# EAGLE design integrator (EAGLE 7.1.0)
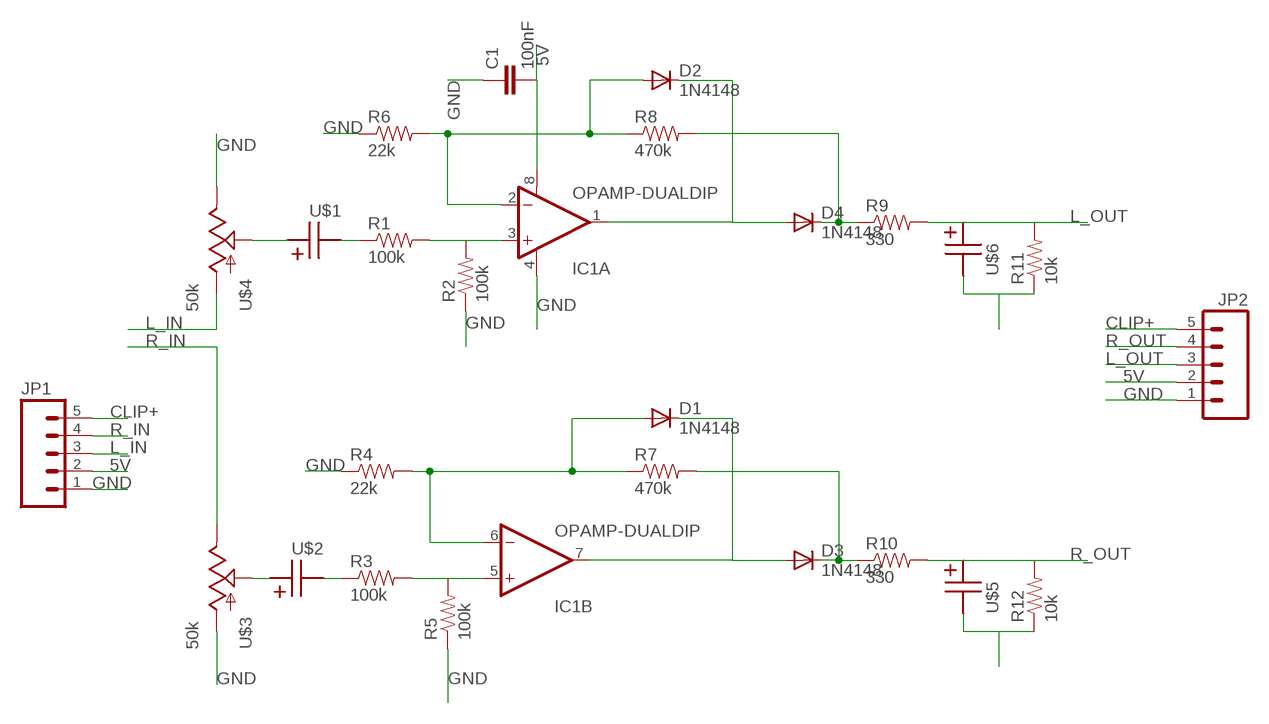
[diagram p0: schematic, sheet 1]

## Parts
C1  100nF  CAP1206  [1206]
D1  1N4148  DIODE1N4148  [DIODE-1N4148]
D2  1N4148  DIODE1N4148  [DIODE-1N4148]
D3  1N4148  DIODE1N4148  [DIODE-1N4148]
D4  1N4148  DIODE1N4148  [DIODE-1N4148]
IC1  OPAMP-DUALDIP  [DIP08]
JP1  M05SMD2  [1X05-1MM-RA]
JP2  M05SMD2  [1X05-1MM-RA]
R1  100k  RESISTORPTH-1/4W  [AXIAL-0.4]
R2  100k  RESISTORPTH-1/4W  [AXIAL-0.4]
R3  100k  RESISTORPTH-1/4W  [AXIAL-0.4]
R4  22k  RESISTORPTH-1/4W  [AXIAL-0.4]
R5  100k  RESISTORPTH-1/4W  [AXIAL-0.4]
R6  22k  RESISTORPTH-1/4W  [AXIAL-0.4]
R7  470k  RESISTORPTH-1/4W  [AXIAL-0.4]
R8  470k  RESISTORPTH-1/4W  [AXIAL-0.4]
R9  330  RESISTORPTH-1/4W  [AXIAL-0.4]
R10  330  RESISTORPTH-1/4W  [AXIAL-0.4]
R11  10k  RESISTORPTH-1/4W  [AXIAL-0.4]
R12  10k  RESISTORPTH-1/4W  [AXIAL-0.4]
U$1  6.8uF  5MM-12.5MM-POLAR2MMX5MM  [2MMLEAD_5MMDIAMETER]
U$2  6.8uF  5MM-12.5MM-POLAR2MMX5MM  [2MMLEAD_5MMDIAMETER]
U$3  50k  POT  [ALPS_POT]
U$4  50k  POT  [ALPS_POT]
U$5  2.2uF  5MM-12.5MM-POLAR2MMX5MM  [2MMLEAD_5MMDIAMETER]
U$6  2.2uF  5MM-12.5MM-POLAR2MMX5MM  [2MMLEAD_5MMDIAMETER]

## Nets
5V: C1.2 IC1.8(A:V+) JP1.2 JP2.2
CLIP+: JP1.5 JP2.5
GND: C1.1 IC1.4(A:V-) JP1.1 JP2.1 R2.P$1 R4.P$1 R5.P$1 R6.P$1 R11.P$1 R12.P$1 U$3.P$3(A) U$4.P$1(E) U$5.- U$6.-
L_IN: JP1.3 U$4.P$3(A)
L_OUT: JP2.3 R9.P$2 R11.P$2 U$6.+
N$2: D1.A IC1.6(B:-IN) R4.P$2 R7.P$1
N$4: D2.A IC1.2(A:-IN) R6.P$2 R8.P$1
N$6: IC1.5(B:+IN) R3.P$2 R5.P$2
N$7: IC1.3(A:+IN) R1.P$2 R2.P$2
N$11: D1.C D3.A IC1.7(B:OUT)
N$12: D3.C R7.P$2 R10.P$1
N$13: D4.C R8.P$2 R9.P$1
N$14: D2.C D4.A IC1.1(A:OUT)
N$15: U$2.+ U$3.P$2(S)
N$16: R1.P$1 U$1.-
N$17: R3.P$1 U$2.-
N$19: U$1.+ U$4.P$2(S)
R_IN: JP1.4 U$3.P$1(E)
R_OUT: JP2.4 R10.P$2 R12.P$2 U$5.+

## Library data of the parts
C1 = SparkFun-Capacitors:CAP: Capacitor Standard 0603 ceramic capacitor, and 0.1" leaded capacitor.
D1-D4 = SparkFun-DiscreteSemi:DIODE: Diode These are standard reverse protection diodes and small signal diodes. SMA package can handle up to about 1A. SOD-323 can handle about 200mA. What the SOD-323 package when ordering, there are some mfgs out there that are 5-pin packages.
IC1 = SparkFun-AnalogIC:OPAMP-DUAL: Generic op-amp footprint
JP1 JP2 = SparkFun-Connectors:M05: Header 5 Standard 5-pin 0.1" header. Use with straight break away headers (SKU : PRT-00116), right angle break away headers (PRT-00553), swiss pins (PRT-00743), machine pins (PRT-00117), and female headers (PRT-00115). Molex polarized connector foot print use with SKU : PRT-08230 with associated crimp pins and housings.
R1-R12 = SparkFun-Resistors:RESISTOR: Resistor Basic schematic elements and footprints for 0603, 1206, and PTH resistors.
U$1 U$2 U$5 U$6 = AMP Library:5MM-12.5MM-POLAR
U$3 U$4 = SparkFun-Electromechanical:POT

## Board
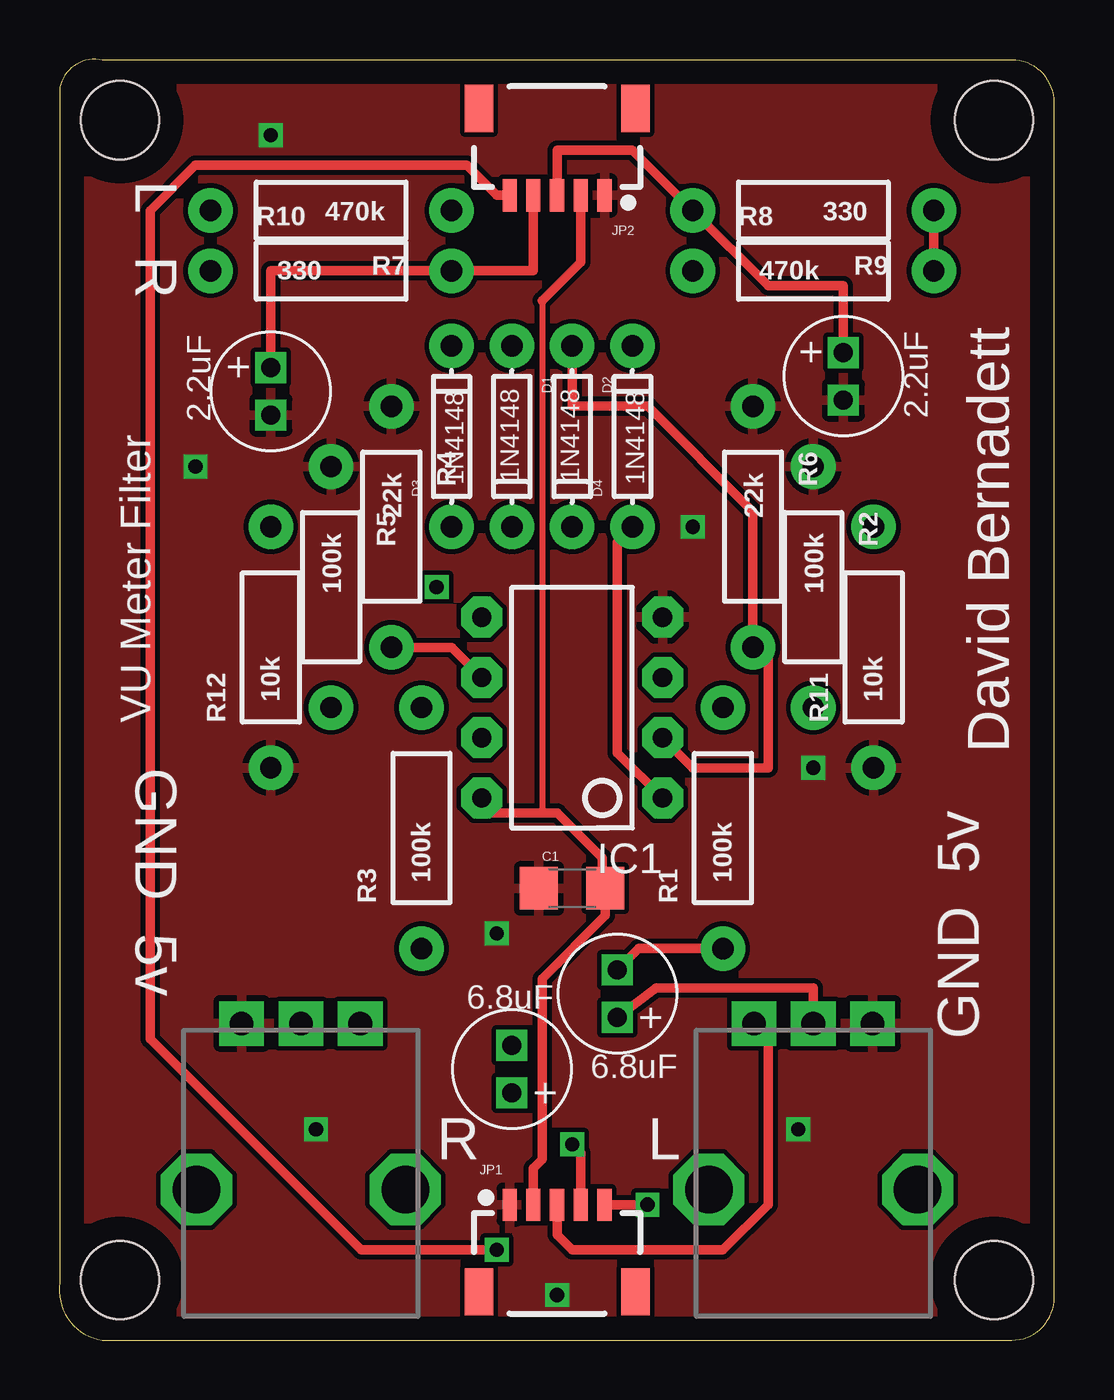
[diagram p1: board, top side]
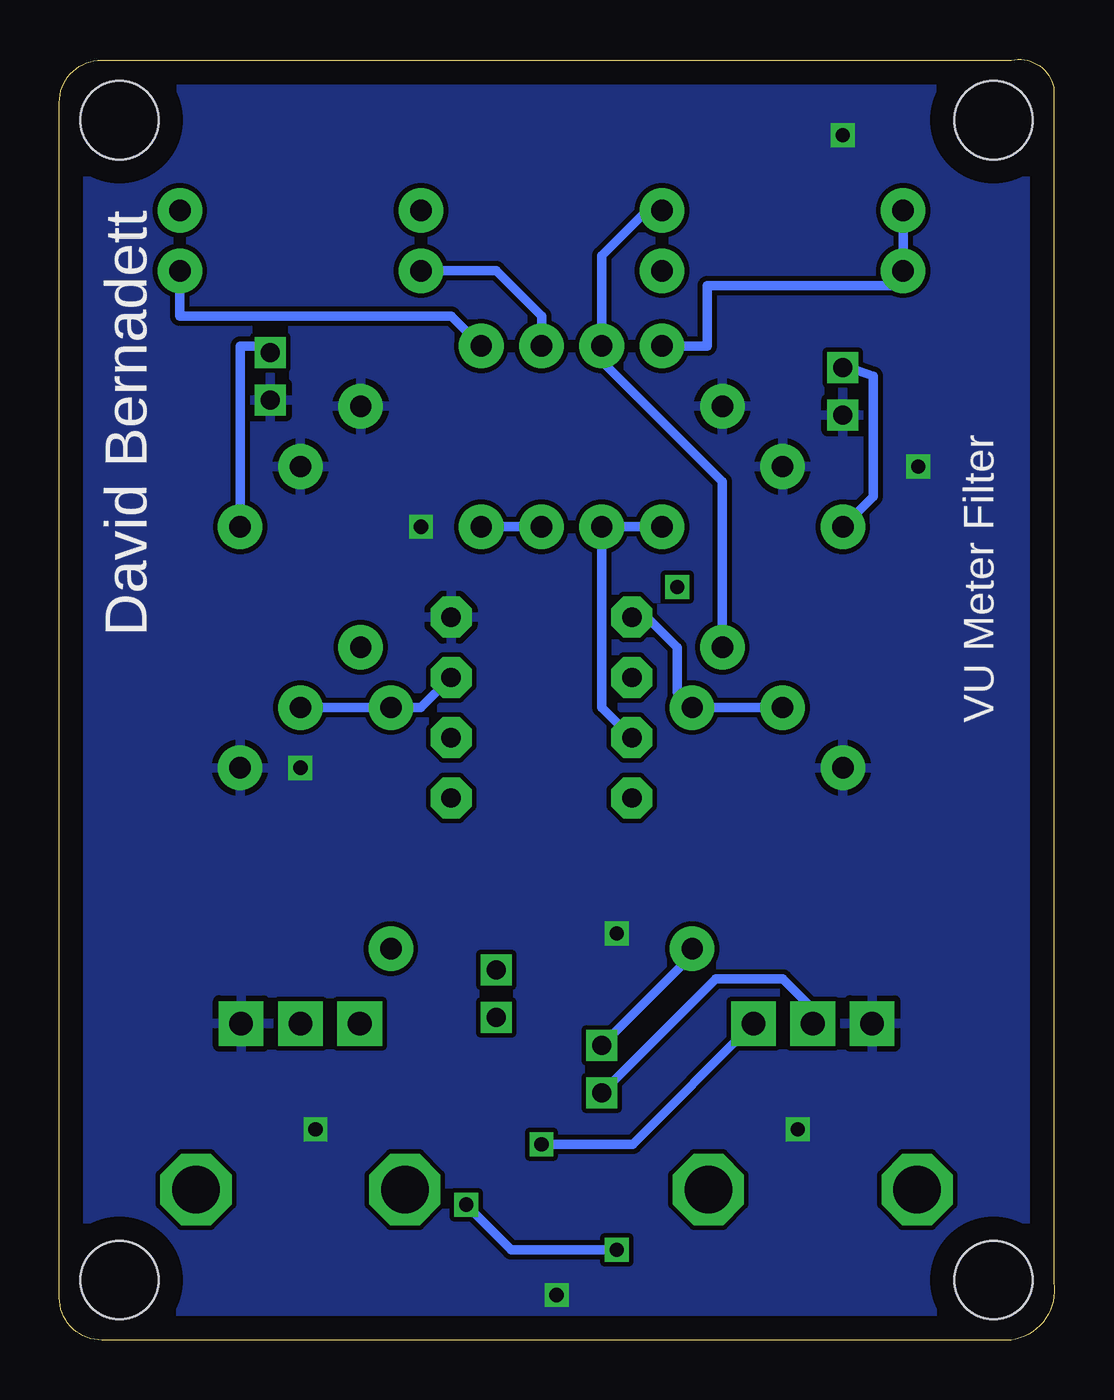
[diagram p2: board, bottom side, seen from below]

Size 41.93 x 54 mm. Coordinates in mm from the lower left corner, seen from the top.
Outline: 0.02,52.81 0.02,2.43 arc90 1.82,0 40.14,0 arc90 41.93,1.8 41.93,52.18 arc90 40.14,53.97 1.81,53.97 arc90 0.02,52.81
Copper layers (1*16): Top 0.035mm / dielectric 1.5mm / Bottom 0.035mm
Design rules "default": minimum track width 10mil, minimum drill 24mil, track to track 8mil, track to pad 8mil, pad to pad 8mil, via to via 8mil, smd to smd 8mil, copper to edge 40mil, drill to drill 8mil, minimum pad ring 10mil, minimum via ring 8mil, stop-mask expansion 4mil, vias tented up to drill 0mil, thermal gap 10mil

### Footprints (pad centres in the part's own frame; a part is rotated, then mirrored left to right if it is on the bottom)
1206 = smd 1.6 x 1.8: 1 -1.4,0; 2 1.4,0
DIODE-1N4148 = drill 0.9 pad 1.88: A -3.81,0; C 3.81,0
DIP08 = drill 0.813 pad 1.727 octagon: 1 -3.81,-3.81; 2 -1.27,-3.81; 3 1.27,-3.81; 4 3.81,-3.81; 5 3.81,3.81; 6 1.27,3.81; 7 -1.27,3.81; 8 -3.81,3.81
1X05-1MM-RA = smd 0.6 x 1.35: 1 -2,0; 2 -1,0; 3 0,0; 4 1,0; 5 2,0 | smd 1.2 x 2: NC1 3.3,-3.675; NC2 -3.3,-3.675
AXIAL-0.4 = drill 0.9 pad 1.88: P$1 -5.08,0; P$2 5.08,0
2MMLEAD_5MMDIAMETER = drill 0.8 square: + 1,0; - -1,0
ALPS_POT = drill 1 pad 1.88 square: P$1 7,-2.5; P$2 7,0; P$3 7,2.5 | drill 2 octagon: P$4 0,-4.4; P$5 0,4.4
STAND-OFF = hole 3.302: 0,0

### Placement (x,y rotation side)
C1  21.61,19.05 0 top
D1  19.07,38.1 270 top
D2  21.61,38.1 270 top
D3  16.53,38.1 90 top
D4  24.15,38.1 90 top
IC1  21.61,26.67 90 top
JP1  20.98,5.71 0 top
JP2  20.98,48.26 180 top
R1  27.96,21.59 90 top
R2  31.77,31.75 270 top
R3  15.26,21.59 90 top
R4  13.99,34.29 270 top
R5  11.45,31.75 270 top
R6  29.23,34.29 270 top
R7  11.45,47.62 180 top
R8  31.77,45.09 0 top
R9  31.77,47.62 180 top
R10  11.45,45.09 0 top
R11  34.31,29.21 90 top
R12  8.91,29.21 90 top
U$1  23.52,14.61 270 top
U$2  19.07,11.43 270 top
U$3  10.18,6.35 90 top
U$4  31.77,6.35 90 top
U$5  8.91,40.01 90 top
U$6  33.04,40.64 90 top
U$7  [STAND-OFF]  2.56,51.44 0 top
U$8  [STAND-OFF]  39.39,51.44 0 top
U$9  [STAND-OFF]  39.39,2.54 0 top
U$10  [STAND-OFF]  2.56,2.54 0 top

### Tracks (layer width: path | path; a pad name or v marks a point on that pad's centre or on a via)
5V
  Top 0.254: 20.34,43.81 20.34,22.23
  Top 0.406: IC1.8 17.8,22.23 20.34,22.23 20.98,22.23 22.88,20.32 22.88,19.42 C1.2 23.01,17.91 20.34,15.24 20.34,7.62 19.98,7.25 JP1.2 | JP2.2 21.98,45.45 20.34,43.81
CLIP+  (via drill 0.6)
  Top 0.406: JP2.5 18.44,48.26 17.17,49.53 5.74,49.53 3.83,47.62 3.83,12.7 12.72,3.81 v18.44,3.81 | v24.79,5.71 JP1.5
  Bottom 0.406: v18.44,3.81 22.88,3.81 v24.79,5.71
GND  (via drill 0.6)
  other vias: 31.77,24.13 26.69,34.29 5.74,36.83 31.14,8.89 10.82,8.89 20.98,1.91 18.44,17.14 8.91,50.8
  pour Bottom: 0.02,53.98 41.93,53.98 41.93,0 0.02,0
  pour Top: 0.02,53.98 41.93,53.98 41.93,0 0.02,0
L_IN
  Top 0.406: JP1.3 20.98,4.45 21.61,3.81 27.96,3.81 29.87,5.71 29.87,12.76 U$4.P$3
L_OUT
  Top 0.406: U$6.+ 33.04,44.45 29.87,44.45 R9.P$2 24.15,50.16 20.98,50.16 JP2.3
  Bottom 0.406: U$6.+ 33.31,41.91 34.31,41.91 R11.P$2
N$2
  Top 0.406: R4.P$2 16.53,29.21 IC1.6
  Bottom 0.406: R4.P$2 13.99,36.2 19.07,41.27 D1.A 19.07,45.72 17.17,47.62 R7.P$1
N$4
  Top 0.406: IC1.2 26.69,24.13 29.87,24.13 29.87,29.21 R6.P$2 29.23,34.92 24.79,39.37 21.61,39.37 D2.A
  Bottom 0.406: D2.A 21.61,43.18 23.52,45.09 R8.P$1
N$6
  Bottom 0.406: R5.P$2 R3.P$2 15.9,27.3 15.9,29.21 17.17,30.48 IC1.5
N$7
  Bottom 0.406: IC1.3 26.69,26.67 R1.P$2 R2.P$2
N$9  (via drill 0.6)
  other vias: 15.9,31.75
N$11
  Bottom 0.406: D3.A D1.C 19.07,26.67 IC1.7
N$12
  Bottom 0.406: R7.P$2 R10.P$1 6.37,44.45 14.63,44.45 14.63,41.91 D3.C
N$13
  Top 0.406: R9.P$1 R8.P$2
  Bottom 0.406: D4.C 25.42,43.18 36.85,43.18 R8.P$2
N$14
  Top 0.406: D4.A 23.52,33.66 23.52,24.77 IC1.1
  Bottom 0.406: D2.C D4.A
N$15
  Bottom 0.406: U$2.+ 14.26,15.24 11.45,15.24 10.18,13.97 U$3.P$2
N$16
  Top 0.406: U$1.- 24.42,16.51 R1.P$1
N$17
  Bottom 0.406: U$2.- 15.26,16.24 R3.P$1
N$19
  Top 0.406: U$1.+ 25.15,14.86 31.77,14.86 U$4.P$2
R_IN  (via drill 0.6)
  Top 0.406: JP1.4 21.98,7.89 v21.61,8.26
  Bottom 0.406: v21.61,8.26 17.78,8.26 U$3.P$1
R_OUT
  Top 0.406: U$5.+ 8.91,45.09 R10.P$2 19.98,45.09 JP2.4
  Bottom 0.406: R12.P$2 7.64,35.56 7.64,40.64 8.64,41.01 U$5.+

### Text on the board
tPlace: 2.2uF | 2.2uF | VU Meter Filter | David Bernadett | 6.8uF | 6.8uF
bPlace: David Bernadett | VU Meter Filter
tNames: L | R | GND | 5v | 5v | GND | R | L